# Altium schematic sheet 2ns RMII.SchDoc
size 220 x 165 mm
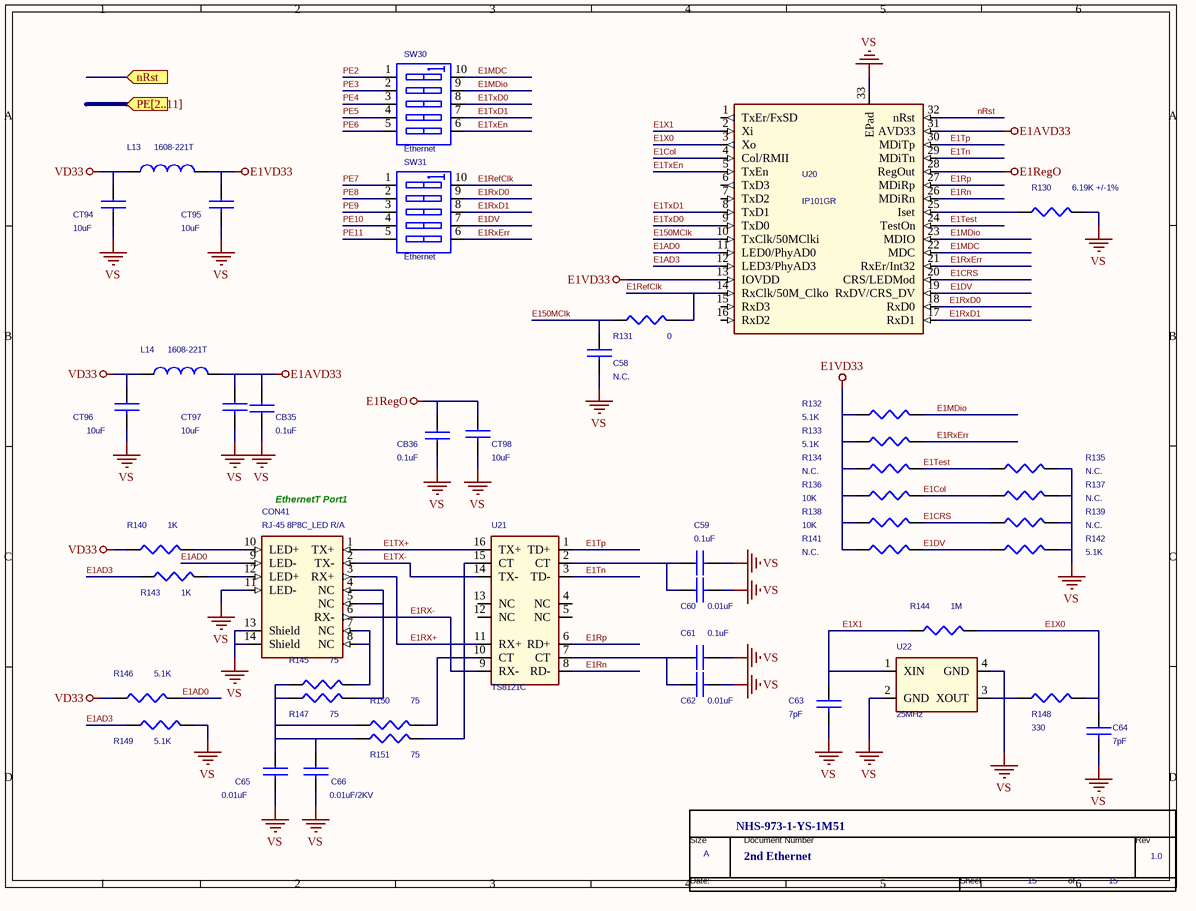
[diagram p0: 2ns RMII.SchDoc]

## Parts
*  RevCode: 1.0  Page Size: A  Page Number: 15  Doc: 2nd Ethernet  OrgName: NHS-973-1-YS-1M51  (hidden comment: TitleBlock0N)  (graphical)
C58  N.C.  [C0603]
C59  0.1uF  [C0603]
C60  0.01uF  [C0603]
C61  0.1uF  [C0603]
C62  0.01uF  [C0603]
C63  7pF  [C0603]
C64  7pF  [C0603]
C65  0.01uF  [C0603]
C66  0.01uF/2KV  [CK05]
CB35  0.1uF  [C0603]
CB36  0.1uF  [C0603]
CON41  RJ-45 8P8C_LED R/A  [RJ45\8P\JA\LED]
CT94  10uF  [C0603]
CT95  10uF  [C0603]
CT96  10uF  [C0603]
CT97  10uF  [C0603]
CT98  10uF  [C0603]
L13  1608-221T  [L0603]
L14  1608-221T  [L0603]
R130  6.19K +/-1%  [R0603]
R131  0  [R0603]
R132  5.1K  [R0603]
R133  5.1K  [R0603]
R134  N.C.  [R0603]
R135  N.C.  [R0603]
R136  10K  [R0603]
R137  N.C.  [R0603]
R138  10K  [R0603]
R139  N.C.  [R0603]
R140  1K  [R0603]
R141  N.C.  [R0603]
R142  5.1K  [R0603]
R143  1K  [R0603]
R144  1M  [R0603]
R145  75  [R0603]
R146  5.1K  [R0603]
R147  75  [R0603]
R148  330  [R0603]
R149  5.1K  [R0603]
R150  75  [R0603]
R151  75  [R0603]
SW30  Ethernet  [DIPSWx5_2.54mm]
SW31  Ethernet  [DIPSWx5_2.54mm]
U20  IP101GR  [QFN32]
U21  TS8121C  [ST6200T]
U22  25MHz  [SOT-143]

## Ports
nRst (in), PE[2..11] (in)

## Nets
E1AVD33: CB35.2 CT97.1 L14.2 U20.31(AVD33)
E1RegO: CB36.2 CT98.1 U20.28(RegOut)
E1VD33: CT95.1 L13.2 R132.2 R133.2 R134.2 R136.2 R138.2 R141.2 U20.13(IOVDD)
VD33: CT94.1 CT96.1 L13.1 L14.1 R140.1 R146.1
VS: C58.2 C59.2 C60.2 C61.2 C62.2 C63.2 C64.2 C65.2 C66.2 CB35.1 CB36.1 CON41.11(LED-) CON41.13(Shield) CON41.14(Shield) CT94.2 CT95.2 CT96.2 CT97.2 CT98.2 R130.1 R135.1 R137.1 R139.1 R142.1 R149.2 U20.33(EPad) U22.2(GND) U22.4(GND)
E1AD0: CON41.9(LED-) R146.2 U20.11(LED0/PhyAD0)
E1AD3: R143.1 R149.1 U20.12(LED3/PhyAD3)
E1Col: R136.1 R137.2 U20.4(Col/RMII)
E1CRS: R138.1 R139.2 U20.20(CRS/LEDMod)
E1DV: R141.1 R142.2 SW31.7(B4) U20.19(RxDV/CRS_DV)
E1MDC: SW30.10(B1) U20.22(MDC)
E1MDio: R132.1 SW30.9(B2) U20.23(MDIO)
E1RefClk: R131.1 SW31.10(B1) U20.14(RxClk/50M_Clko)
E1Rn: U20.26(MDiRn) U21.8(RD-)
E1Rp: U20.27(MDiRp) U21.6(RD+)
E1RX+: CON41.3(RX+) U21.11(RX+)
E1RX-: CON41.6(RX-) U21.9(RX-)
E1RxD0: SW31.9(B2) U20.18(RxD0)
E1RxD1: SW31.8(B3) U20.17(RxD1)
E1RxErr: R133.1 SW31.6(B5) U20.21(RxEr/Int32)
E1Test: R134.1 R135.2 U20.24(TestOn)
E1Tn: U20.29(MDiTn) U21.3(TD-)
E1Tp: U20.30(MDiTp) U21.1(TD+)
E1TX+: CON41.1(TX+) U21.16(TX+)
E1TX-: CON41.2(TX-) U21.14(TX-)
E1TxD0: SW30.8(B3) U20.9(TxD0)
E1TxD1: SW30.7(B4) U20.8(TxD1)
E1TxEn: SW30.6(B5) U20.5(TxEn)
E1X0: C64.1 R144.1 R148.2 U20.3(Xo)
E1X1: C63.1 R144.2 U20.2(Xi) U22.1(XIN)
E150MClk: C58.1 R131.2 U20.10(TxClk/50MClki)
nRst: U20.32(nRst)
PE2: SW30.1(A1)
PE3: SW30.2(A2)
PE4: SW30.3(A3)
PE5: SW30.4(A4)
PE6: SW30.5(A5)
PE7: SW31.1(A1)
PE8: SW31.2(A2)
PE9: SW31.3(A3)
PE10: SW31.4(A4)
PE11: SW31.5(A5)
NetC59_1: C59.1 C60.1 U21.2(CT)
NetC61_1: C61.1 C62.1 U21.7(CT)
NetC65_1: C65.1 C66.1 R145.1 R147.1 R150.1 R151.1
NetCON41_4: CON41.4(NC) CON41.5(NC) R147.2
NetCON41_7: CON41.7(NC) CON41.8(NC) R145.2
NetCON41_10: CON41.10(LED+) R140.2
NetCON41_12: CON41.12(LED+) R143.2
NetR130_2: R130.2 U20.25(Iset)
NetR148_1: R148.1 U22.3(XOUT)
NetR150_2: R150.2 U21.10(CT)
NetR151_2: R151.2 U21.15(CT)

Not connected (* = marked no-connect by the designer): U20 1(TxEr/FxSD) 6(TxD3) 7(TxD2) 15(RxD3) 16(RxD2); U21 4(NC) 5(NC) 12(NC) 13(NC)

## Notes on the sheet
- (near CON41) EthernetT Port1
- (in symbol TitleBlock0N) Size; Document Number; Rev; Date:; Sheet; of

## Library data of the parts
C58-C66 CB35 CB36 CT94-CT98 = CAP NP
CON41 = RJ45_SHLD_0
L13 L14 = INDUCTOR
R130-R151 = R
SW30 SW31 = SW DIP-5_0
U20 = IP101GA_0
U21 = PE-68515_1
U22 = Crystal_SMD_2: Vendor: Aurum
* = TitleBlock0N: Page Create Date: April 25, 1995; Page Count: 15